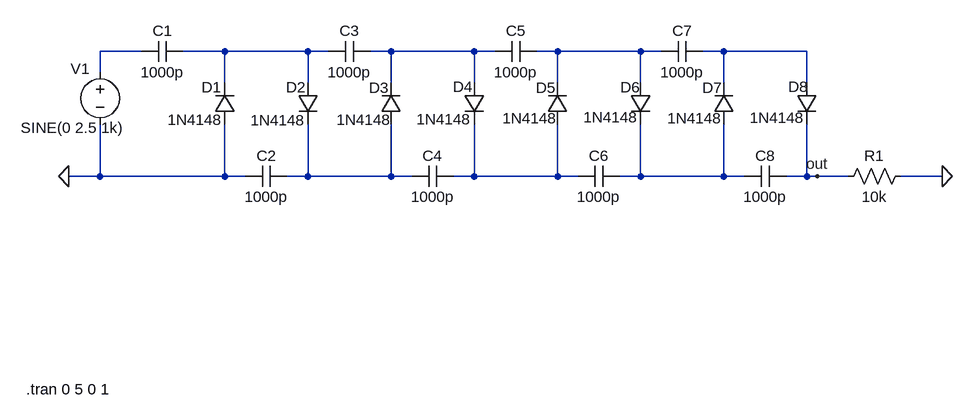
[diagram p0: schematic Draft1.asc]
Draft1.asc, the LTspice schematic file:
Version 4
SHEET 1 1124 680
WIRE -304 -608 -368 -608
WIRE -176 -608 -240 -608
WIRE -48 -608 -176 -608
WIRE -16 -608 -48 -608
WIRE 80 -608 48 -608
WIRE 208 -608 80 -608
WIRE 240 -608 208 -608
WIRE 336 -608 304 -608
WIRE 464 -608 336 -608
WIRE 496 -608 464 -608
WIRE 592 -608 560 -608
WIRE 720 -608 592 -608
WIRE -368 -576 -368 -608
WIRE -176 -560 -176 -608
WIRE -48 -560 -48 -608
WIRE 80 -560 80 -608
WIRE 208 -560 208 -608
WIRE 336 -560 336 -608
WIRE 464 -560 464 -608
WIRE 592 -560 592 -608
WIRE 720 -560 720 -608
WIRE -368 -416 -368 -496
WIRE -368 -416 -416 -416
WIRE -176 -416 -176 -496
WIRE -176 -416 -368 -416
WIRE -144 -416 -176 -416
WIRE -48 -416 -48 -496
WIRE -48 -416 -80 -416
WIRE 80 -416 80 -496
WIRE 80 -416 -48 -416
WIRE 112 -416 80 -416
WIRE 208 -416 208 -496
WIRE 208 -416 176 -416
WIRE 336 -416 336 -496
WIRE 336 -416 208 -416
WIRE 368 -416 336 -416
WIRE 464 -416 464 -496
WIRE 464 -416 432 -416
WIRE 592 -416 592 -496
WIRE 592 -416 464 -416
WIRE 624 -416 592 -416
WIRE 720 -416 720 -496
WIRE 720 -416 688 -416
WIRE 736 -416 720 -416
WIRE 784 -416 736 -416
WIRE 928 -416 864 -416
FLAG -416 -416 0
FLAG 736 -416 out
FLAG 928 -416 0
SYMBOL voltage -368 -592 R0
WINDOW 0 -31 -5 Top 2
WINDOW 3 -43 117 Bottom 2
WINDOW 123 0 0 Left 0
WINDOW 39 0 0 Left 0
SYMATTR InstName V1
SYMATTR Value SINE(0 2.5 1k)
SYMBOL cap -240 -624 R90
WINDOW 0 0 32 VBottom 2
WINDOW 3 32 32 VTop 2
SYMATTR InstName C1
SYMATTR Value 1000p
SYMBOL diode -160 -496 R180
WINDOW 0 21 57 Left 2
WINDOW 3 19 7 Left 2
SYMATTR InstName D1
SYMATTR Value 1N4148
SYMBOL diode -64 -560 R0
WINDOW 3 -72 58 Left 2
WINDOW 0 -18 7 Left 2
SYMATTR Value 1N4148
SYMATTR InstName D2
SYMBOL cap -80 -432 R90
WINDOW 0 0 32 VBottom 2
WINDOW 3 32 32 VTop 2
SYMATTR InstName C2
SYMATTR Value 1000p
SYMBOL cap 48 -624 R90
WINDOW 0 0 32 VBottom 2
WINDOW 3 32 32 VTop 2
SYMATTR InstName C3
SYMATTR Value 1000p
SYMBOL diode 96 -496 R180
WINDOW 0 19 56 Left 2
WINDOW 3 15 7 Left 2
SYMATTR InstName D3
SYMATTR Value 1N4148
SYMBOL diode 192 -560 R0
WINDOW 3 -73 56 Left 2
WINDOW 0 -17 6 Left 2
SYMATTR Value 1N4148
SYMATTR InstName D4
SYMBOL cap 176 -432 R90
WINDOW 0 0 32 VBottom 2
WINDOW 3 32 32 VTop 2
SYMATTR InstName C4
SYMATTR Value 1000p
SYMBOL cap 304 -624 R90
WINDOW 0 0 32 VBottom 2
WINDOW 3 32 32 VTop 2
SYMATTR InstName C5
SYMATTR Value 1000p
SYMBOL diode 352 -496 R180
WINDOW 0 18 56 Left 2
WINDOW 3 16 9 Left 2
SYMATTR InstName D5
SYMATTR Value 1N4148
SYMBOL diode 448 -560 R0
WINDOW 3 -72 53 Left 2
WINDOW 0 -15 7 Left 2
SYMATTR Value 1N4148
SYMATTR InstName D6
SYMBOL cap 432 -432 R90
WINDOW 0 0 32 VBottom 2
WINDOW 3 32 32 VTop 2
SYMATTR InstName C6
SYMATTR Value 1000p
SYMBOL cap 560 -624 R90
WINDOW 0 0 32 VBottom 2
WINDOW 3 32 32 VTop 2
SYMATTR InstName C7
SYMATTR Value 1000p
SYMBOL diode 608 -496 R180
WINDOW 0 18 56 Left 2
WINDOW 3 18 9 Left 2
SYMATTR InstName D7
SYMATTR Value 1N4148
SYMBOL diode 704 -560 R0
WINDOW 0 -13 6 Left 2
WINDOW 3 -72 54 Left 2
SYMATTR InstName D8
SYMATTR Value 1N4148
SYMBOL cap 688 -432 R90
WINDOW 0 0 32 VBottom 2
WINDOW 3 32 32 VTop 2
SYMATTR InstName C8
SYMATTR Value 1000p
SYMBOL res 768 -400 R270
WINDOW 0 32 56 VTop 2
WINDOW 3 0 56 VBottom 2
SYMATTR InstName R1
SYMATTR Value 10k
TEXT -352 -88 Right 2 !.tran 0 5 0 1

The netlist it stands for:
* Draft1.asc
V1 N001 0 SINE(0 2.5 1k)
C1 N002 N001 1000p
D1 0 N002 1N4148
D2 N002 N006 1N4148
C2 N006 0 1000p
C3 N003 N002 1000p
D3 N006 N003 1N4148
D4 N003 N007 1N4148
C4 N007 N006 1000p
C5 N004 N003 1000p
D5 N007 N004 1N4148
D6 N004 N008 1N4148
C6 N008 N007 1000p
C7 N005 N004 1000p
D7 N008 N005 1N4148
D8 N005 out 1N4148
C8 out N008 1000p
R1 out 0 10k
.model D D
.lib standard.dio
.tran 0 5 0 1
.backanno
.end